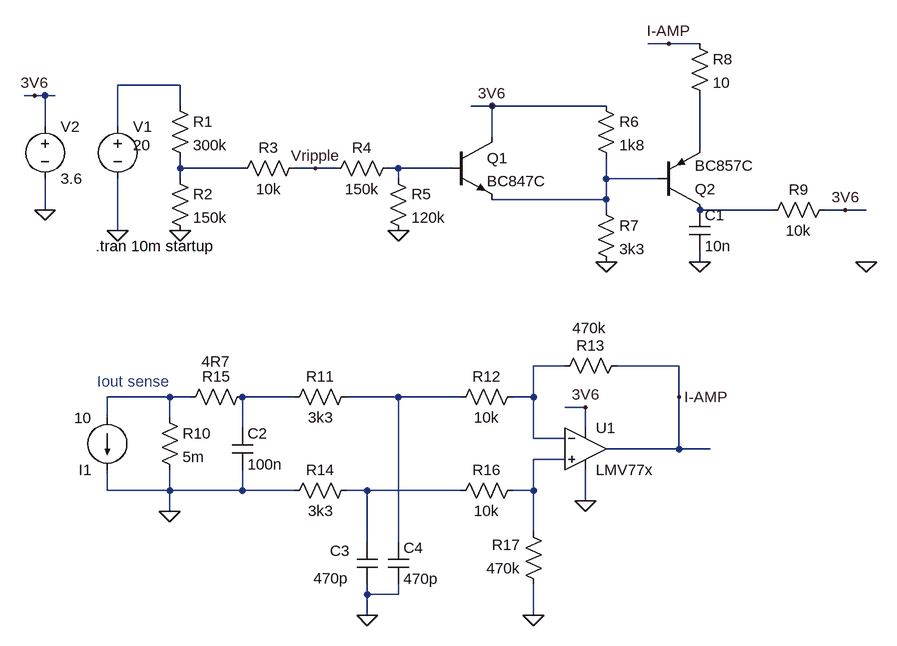
[diagram p0: schematic VRipple.asc]
VRipple.asc, the LTspice schematic file:
Version 4
SHEET 1 1160 884
WIRE 656 -16 624 -16
WIRE 704 -16 656 -16
WIRE -96 48 -192 48
WIRE -320 64 -336 64
WIRE -304 64 -320 64
WIRE -288 64 -304 64
WIRE -96 80 -96 48
WIRE 384 80 352 80
WIRE 560 80 384 80
WIRE -304 112 -304 64
WIRE -192 112 -192 48
WIRE 384 128 384 80
WIRE 704 144 704 64
WIRE -96 176 -96 160
WIRE 0 176 -96 176
WIRE 112 176 80 176
WIRE 144 176 112 176
WIRE 240 176 224 176
WIRE 320 176 240 176
WIRE -96 192 -96 176
WIRE 240 192 240 176
WIRE 560 192 560 160
WIRE 640 192 560 192
WIRE 560 224 560 192
WIRE 560 224 384 224
WIRE -304 240 -304 192
WIRE 560 240 560 224
WIRE 816 240 704 240
WIRE 928 240 896 240
WIRE 960 240 928 240
WIRE -192 272 -192 192
WIRE -192 272 -208 272
WIRE 704 320 704 304
WIRE 496 480 448 480
WIRE 672 480 576 480
WIRE -112 528 -208 528
WIRE -80 528 -112 528
WIRE 80 528 0 528
WIRE 240 528 160 528
WIRE 336 528 240 528
WIRE 448 528 448 480
WIRE 448 528 416 528
WIRE 672 528 672 480
WIRE 528 544 496 544
WIRE -208 560 -208 528
WIRE -112 560 -112 528
WIRE 0 576 0 528
WIRE 528 576 528 544
WIRE 448 592 448 528
WIRE 496 592 448 592
WIRE 672 608 672 528
WIRE 672 608 560 608
WIRE 720 608 672 608
WIRE 496 624 448 624
WIRE -208 672 -208 640
WIRE -112 672 -112 640
WIRE -112 672 -208 672
WIRE 0 672 0 640
WIRE 0 672 -112 672
WIRE 80 672 0 672
WIRE 192 672 160 672
WIRE 336 672 192 672
WIRE 448 672 448 624
WIRE 448 672 416 672
WIRE 528 688 528 640
WIRE -112 704 -112 672
WIRE 448 736 448 672
WIRE 192 752 192 672
WIRE 240 752 240 528
WIRE 192 832 192 816
WIRE 240 832 240 816
WIRE 240 832 192 832
WIRE 192 864 192 832
WIRE 448 864 448 816
FLAG -96 272 0
FLAG -192 272 0
FLAG 240 272 0
FLAG 384 80 3V6
FLAG -320 64 3V6
FLAG 560 320 0
FLAG 704 320 0
FLAG 112 176 Vripple
FLAG 960 320 0
FLAG -112 704 0
FLAG 528 688 0
FLAG 528 544 3V6
FLAG 192 864 0
FLAG 448 864 0
FLAG 672 528 I-AMP
FLAG 656 -16 I-AMP
FLAG 928 240 3V6
FLAG -304 240 0
SYMBOL res -112 64 R0
SYMATTR InstName R1
SYMATTR Value 300k
SYMBOL res -112 176 R0
SYMATTR InstName R2
SYMATTR Value 150k
SYMBOL res 96 160 R90
WINDOW 0 0 56 VBottom 2
WINDOW 3 32 56 VTop 2
SYMATTR InstName R3
SYMATTR Value 10k
SYMBOL voltage -192 96 R0
WINDOW 3 24 44 Left 2
WINDOW 123 0 0 Left 0
WINDOW 39 0 0 Left 0
SYMATTR InstName V1
SYMATTR Value 20
SYMBOL res 240 160 R90
WINDOW 0 0 56 VBottom 2
WINDOW 3 32 56 VTop 2
SYMATTR InstName R4
SYMATTR Value 150k
SYMBOL res 224 176 R0
SYMATTR InstName R5
SYMATTR Value 120k
SYMBOL npn 320 128 R0
SYMATTR InstName Q1
SYMATTR Value BC847C
SYMBOL res 544 64 R0
SYMATTR InstName R6
SYMATTR Value 1k8
SYMBOL res 544 224 R0
SYMATTR InstName R7
SYMATTR Value 3k3
SYMBOL pnp 640 240 M180
SYMATTR InstName Q2
SYMATTR Value BC857C
SYMBOL cap 688 240 R0
SYMATTR InstName C1
SYMATTR Value 10n
SYMBOL res 688 -32 R0
SYMATTR InstName R8
SYMATTR Value 10
SYMBOL res 912 224 R90
WINDOW 0 0 56 VBottom 2
WINDOW 3 32 56 VTop 2
SYMATTR InstName R9
SYMATTR Value 10k
SYMBOL res -128 544 R0
SYMATTR InstName R10
SYMATTR Value 5m
SYMBOL current -208 560 M0
WINDOW 0 24 80 Left 2
WINDOW 3 24 0 Left 2
WINDOW 123 0 0 Left 0
WINDOW 39 0 0 Left 0
SYMATTR InstName I1
SYMATTR Value 10
SYMBOL res 176 512 R90
WINDOW 0 0 56 VBottom 2
WINDOW 3 32 56 VTop 2
SYMATTR InstName R11
SYMATTR Value 3k3
SYMBOL res 432 512 R90
WINDOW 0 0 56 VBottom 2
WINDOW 3 32 56 VTop 2
SYMATTR InstName R12
SYMATTR Value 10k
SYMBOL res 592 464 R90
WINDOW 0 0 56 VBottom 2
WINDOW 3 -58 58 VTop 2
SYMATTR InstName R13
SYMATTR Value 470k
SYMBOL res 176 656 R90
WINDOW 0 0 56 VBottom 2
WINDOW 3 32 56 VTop 2
SYMATTR InstName R14
SYMATTR Value 3k3
SYMBOL res 16 512 R90
WINDOW 0 0 56 VBottom 2
WINDOW 3 -54 57 VTop 2
SYMATTR InstName R15
SYMATTR Value 4R7
SYMBOL cap -16 576 R0
SYMATTR InstName C2
SYMATTR Value 100n
SYMBOL res 432 656 R90
WINDOW 0 0 56 VBottom 2
WINDOW 3 32 56 VTop 2
SYMATTR InstName R16
SYMATTR Value 10k
SYMBOL cap 176 752 R0
WINDOW 0 -41 13 Left 2
WINDOW 3 -67 55 Left 2
SYMATTR InstName C3
SYMATTR Value 470p
SYMBOL cap 224 752 R0
SYMATTR InstName C4
SYMATTR Value 470p
SYMBOL res 464 832 R180
WINDOW 0 36 76 Left 2
WINDOW 3 36 40 Left 2
SYMATTR InstName R17
SYMATTR Value 470k
SYMBOL AutoGenerated\\LMV77x 528 608 R0
SYMATTR InstName U1
SYMBOL voltage -304 96 R0
WINDOW 123 0 0 Left 0
WINDOW 39 0 0 Left 0
SYMATTR InstName V2
SYMATTR Value 3.6
TEXT -226 296 Left 2 !.tran 10m startup
TEXT -224 504 Left 2 ;Iout sense

The netlist it stands for:
* VRipple.asc
R1 N001 N003 300k
R2 N003 0 150k
R3 Vripple N003 10k
V1 N001 0 20
R4 N004 Vripple 150k
R5 N004 0 120k
Q1 3V6 N004 N005 0 BC847C
R6 3V6 N005 1k8
R7 N005 0 3k3
Q2 N006 N005 N002 0 BC857C
C1 N006 0 10n
R8 I-AMP N002 10
R9 3V6 N006 10k
R10 N008 0 5m
I1 N008 0 10
R11 N010 N009 3k3
R12 N007 N010 10k
R13 I-AMP N007 470k
R14 N012 0 3k3
R15 N009 N008 4R7
C2 N009 0 100n
R16 N011 N012 10k
C3 N012 0 470p
C4 N010 0 470p
R17 0 N011 470k
* U1: LMV77x (symbol AutoGenerated\LMV77x not available, pins judged from their places): In+=N011 In-=N007 V+=3V6 V-=0 OUT=I-AMP
V2 3V6 0 3.6
.model NPN NPN
.model PNP PNP
.lib standard.bjt
.tran 10m startup
* Iout sense
.backanno
.end